# EAGLE design kinesisBLE V3 (EAGLE 9.1.3)
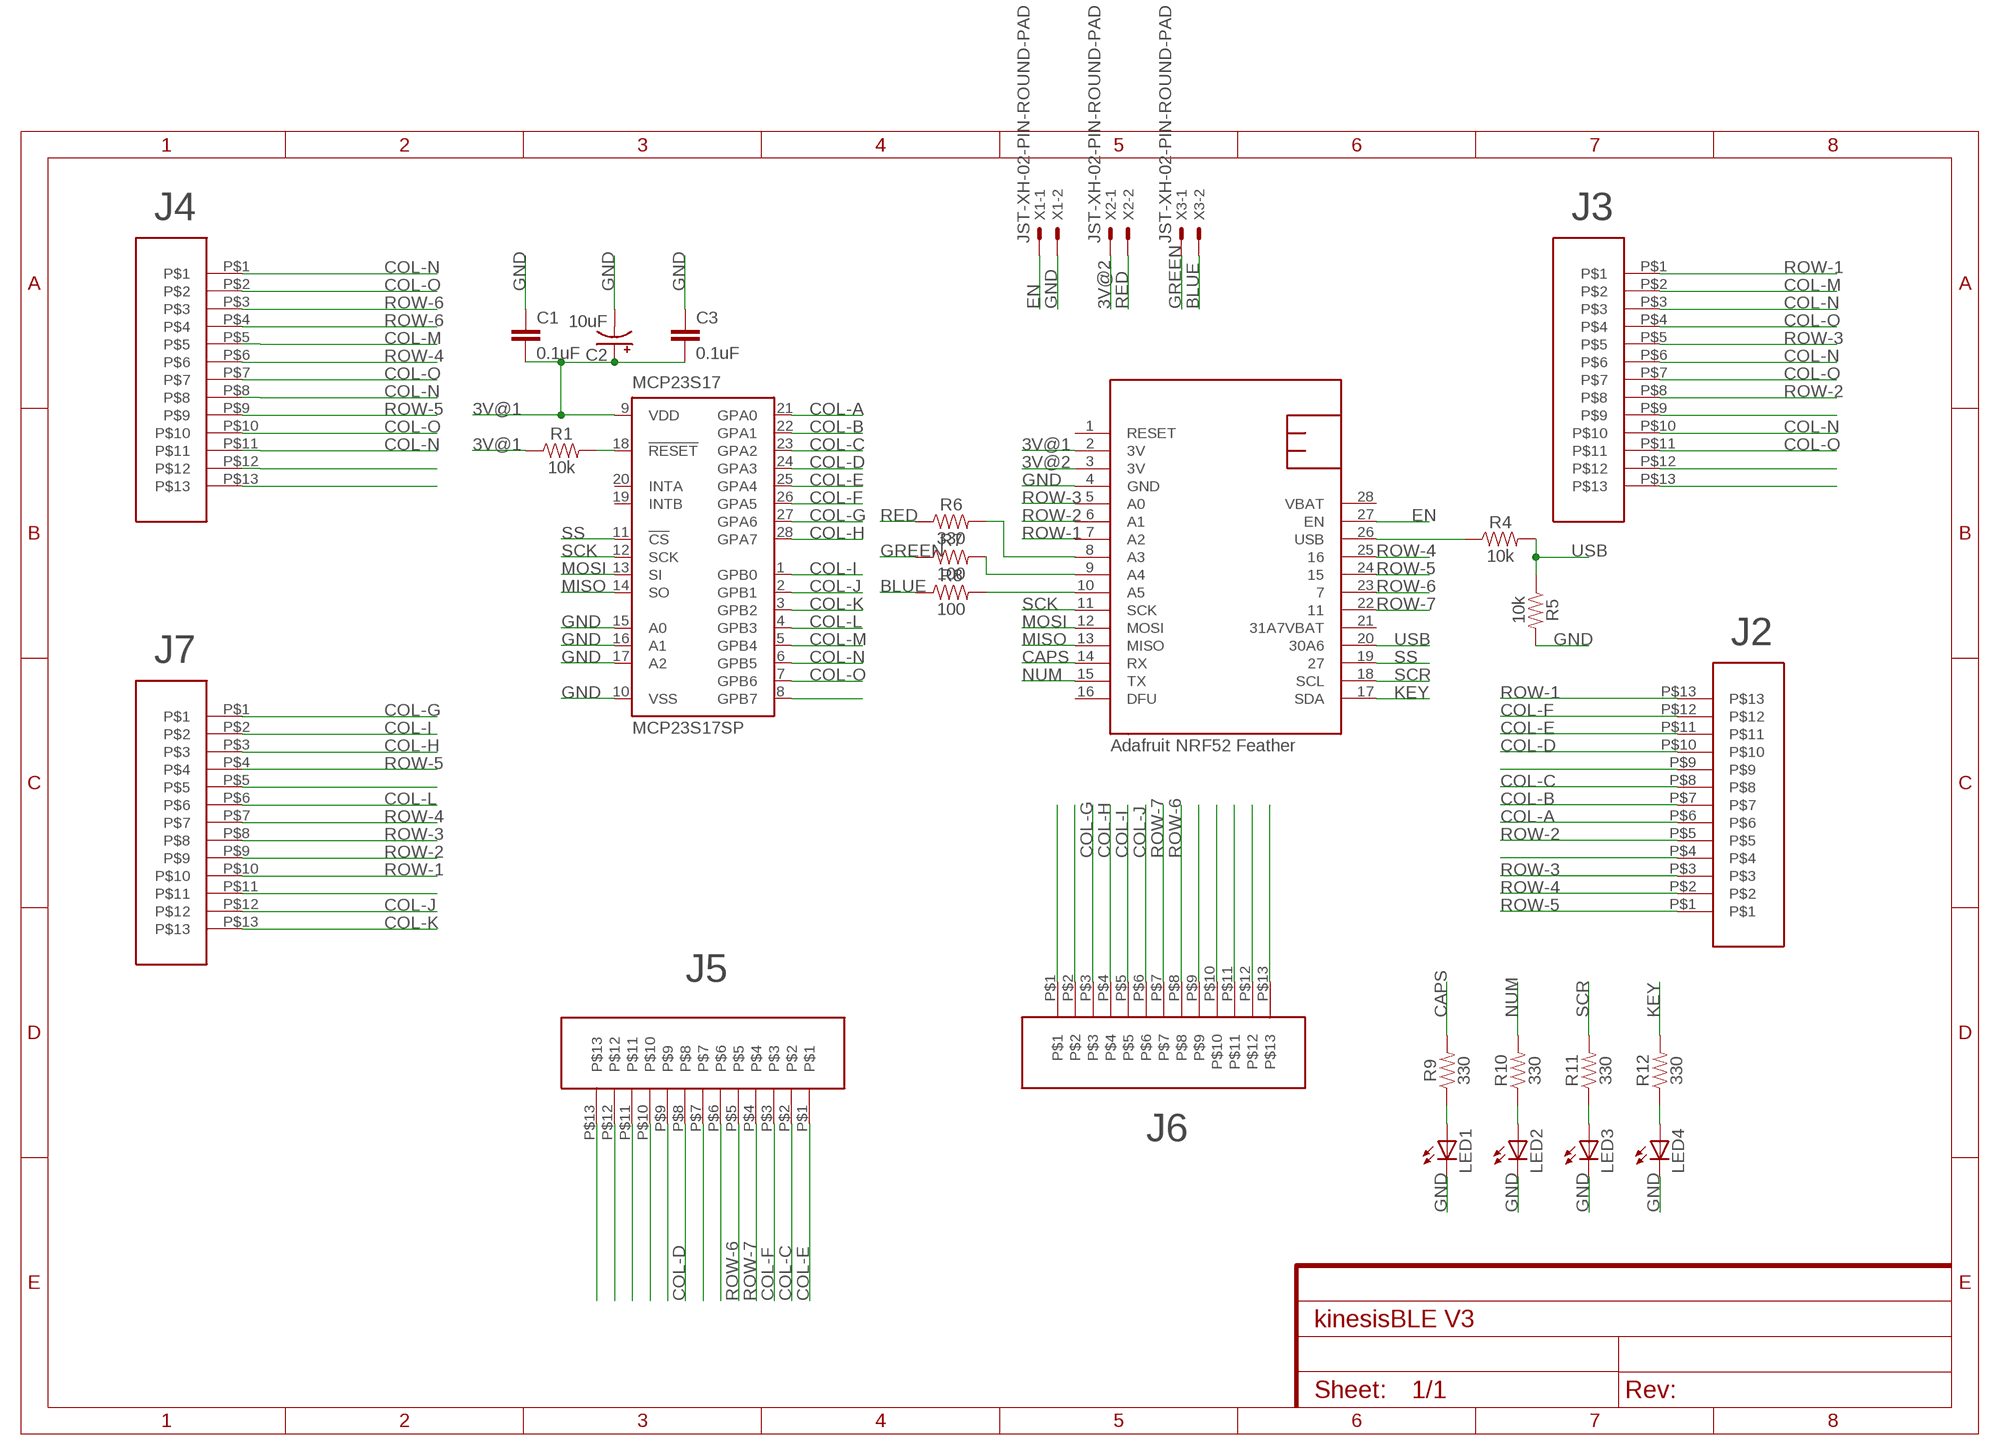
[diagram p0: schematic, sheet 1]

## Parts
C1  0.1uF  0.1UF-KIT-EZ-50V-20%  [CAP-PTH-SMALL-KIT]
C2  10uF  10UF-POLAR-RADIAL-2.5MM-25V-20%  [CPOL-RADIAL-2.5MM-5MM]
C3  0.1uF  0.1UF-KIT-EZ-50V-20%  [CAP-PTH-SMALL-KIT]
LED1  LED3MM  [LED3MM]
LED2  LED3MM  [LED3MM]
LED3  LED3MM  [LED3MM]
LED4  LED3MM  [LED3MM]
MCP23S17  MCP23S17SP  [DIL28-3]
R1  10k  10KOHM-HORIZ-1/4W-5%  [AXIAL-0.3]
R4  10k  10KOHM-HORIZ-1/4W-5%  [AXIAL-0.3]
R5  10k  10KOHM-HORIZ-1/4W-5%  [AXIAL-0.3]
R6  330  330OHM-HORIZ-1/10W-5%  [AXIAL-0.3]
R7  100  100OHM-HORIZ-1/4W-1%  [AXIAL-0.3]
R8  100  100OHM-HORIZ-1/4W-1%  [AXIAL-0.3]
R9  330  330OHM-HORIZ-1/10W-5%  [AXIAL-0.3]
R10  330  330OHM-HORIZ-1/10W-5%  [AXIAL-0.3]
R11  330  330OHM-HORIZ-1/10W-5%  [AXIAL-0.3]
R12  330  330OHM-HORIZ-1/10W-5%  [AXIAL-0.3]
U$1  NRF52FEATHER  [NRF52FEATHER]
U$2  TOPLINKS_STAPELBERG  [TOPLINKS_STAPELBERG]
U$3  TOPLINKS_STAPELBERG  [TOPLINKS_STAPELBERG]
U$4  TOPLINKS_STAPELBERG  [TOPLINKS_STAPELBERG]
U$5  TOPLINKS_STAPELBERG  [TOPLINKS_STAPELBERG]
U$6  TOPLINKS_STAPELBERG  [TOPLINKS_STAPELBERG]
U$7  TOPLINKS_STAPELBERG  [TOPLINKS_STAPELBERG]
X1  JST-XH-02-PIN-ROUND-PAD  [JST-XH-02-PACKAGE-ROUND-PAD]
X2  JST-XH-02-PIN-ROUND-PAD  [JST-XH-02-PACKAGE-ROUND-PAD]
X3  JST-XH-02-PIN-ROUND-PAD  [JST-XH-02-PACKAGE-ROUND-PAD]

## Nets
3V@1: C1.2 C2.1(+) C3.2 MCP23S17.9(VDD) R1.P$1 U$1.2(3V)
3V@2: U$1.3(3V) X2.1
BLUE: R8.P$1 X3.2
CAPS: R9.P$2 U$1.14(RX)
COL-A: MCP23S17.21(GPA0) U$5.P$6
COL-B: MCP23S17.22(GPA1) U$5.P$7
COL-C: MCP23S17.23(GPA2) U$5.P$8 U$6.P$2
COL-D: MCP23S17.24(GPA3) U$5.P$10 U$6.P$8
COL-E: MCP23S17.25(GPA4) U$5.P$11 U$6.P$1
COL-F: MCP23S17.26(GPA5) U$5.P$12 U$6.P$3
COL-G: MCP23S17.27(GPA6) U$4.P$1 U$7.P$3
COL-H: MCP23S17.28(GPA7) U$4.P$3 U$7.P$4
COL-I: MCP23S17.1(GPB0) U$4.P$2 U$7.P$5
COL-J: MCP23S17.2(GPB1) U$4.P$12 U$7.P$6
COL-K: MCP23S17.3(GPB2) U$4.P$13
COL-L: MCP23S17.4(GPB3) U$4.P$6
COL-M: MCP23S17.5(GPB4) U$2.P$5 U$3.P$2
COL-N: MCP23S17.6(GPB5) U$2.P$1 U$2.P$8 U$2.P$11 U$3.P$3 U$3.P$6 U$3.P$10
COL-O: MCP23S17.7(GPB6) U$2.P$2 U$2.P$7 U$2.P$10 U$3.P$4 U$3.P$7 U$3.P$11
EN: U$1.27(EN) X1.1
GND: C1.1 C2.2(-) C3.1 LED1.K(C) LED2.K(C) LED3.K(C) LED4.K(C) MCP23S17.10(VSS) MCP23S17.15(A0) MCP23S17.16(A1) MCP23S17.17(A2) R5.P$2 U$1.4(GND) X1.2
GREEN: R7.P$1 X3.1
KEY: R12.P$2 U$1.17(SDA)
MISO: MCP23S17.14(SO) U$1.13(MISO)
MOSI: MCP23S17.13(SI) U$1.12(MOSI)
N$1: LED1.A R9.P$1
N$2: U$3.P$13
N$3: U$3.P$12
N$4: MCP23S17.18(!RESET) R1.P$2
N$5: R4.P$1 U$1.26(USB)
N$6: U$3.P$9
N$7: R6.P$2 U$1.8(A3)
N$8: R7.P$2 U$1.9(A4)
N$9: R8.P$2 U$1.10(A5)
N$10: LED2.A R10.P$1
N$11: LED3.A R11.P$1
N$12: LED4.A R12.P$1
N$19: U$5.P$9
N$21: MCP23S17.8(GPB7)
N$24: U$5.P$4
N$39: U$2.P$12
N$40: U$2.P$13
N$44: U$4.P$5
N$50: U$4.P$11
N$54: U$6.P$13
N$55: U$6.P$11
N$56: U$6.P$12
N$57: U$6.P$10
N$58: U$6.P$9
N$60: U$6.P$7
N$61: U$6.P$6
N$67: U$7.P$1
N$68: U$7.P$2
N$75: U$7.P$9
N$76: U$7.P$10
N$77: U$7.P$11
N$78: U$7.P$12
N$79: U$7.P$13
NUM: R10.P$2 U$1.15(TX)
RED: R6.P$1 X2.2
ROW-1: U$1.7(A2) U$3.P$1 U$4.P$10 U$5.P$13
ROW-2: U$1.6(A1) U$3.P$8 U$4.P$9 U$5.P$5
ROW-3: U$1.5(A0) U$3.P$5 U$4.P$8 U$5.P$3
ROW-4: U$1.25 U$2.P$6 U$4.P$7 U$5.P$2
ROW-5: U$1.24 U$2.P$9 U$4.P$4 U$5.P$1
ROW-6: U$1.23 U$2.P$3 U$2.P$4 U$6.P$5 U$7.P$8
ROW-7: U$1.22 U$6.P$4 U$7.P$7
SCK: MCP23S17.12(SCK) U$1.11(SCK)
SCR: R11.P$2 U$1.18(SCL)
SS: MCP23S17.11(!CS) U$1.19
USB: R4.P$2 R5.P$1 U$1.20(30A6)
Unconnected: MCP23S17.19(INTB) MCP23S17.20(INTA) U$1.1(RESET) U$1.16(DFU) U$1.21(31A7VBAT)

## Notes on the sheet
- J4 | J3
- J2
- J7
- Adafruit NRF52 Feather
- J5
- J6

## Power pins joined to a net without a drawn wire
VBAT: U$1.28(VBAT)

## Library data of the parts
C1 C3 = SparkFun-Capacitors:0.1UF: 0.1µF ceramic capacitors A capacitor is a passive two-terminal electrical component used to store electrical energy temporarily in an electric field.; PROD_ID: CAP-08370
C2 = SparkFun-Capacitors:10UF-POLAR: 10.0µF polarized capacitors A capacitor is a passive two-terminal electrical component used to store electrical energy temporarily in an electric field.; PROD_ID: CAP-08440
LED1-LED4 = adafruit:LED: LED OSRAM: - CHIPLED LG R971, LG N971, LY N971, LG Q971, LY Q971, LO R971, LY R971 LH N974, LH R974 LS Q976, LO Q976, LY Q976 LO Q996 - Hyper CHIPLED LW Q18S LB Q993, LB Q99A, LB R99A - SideLED LS A670, LO A670, LY A670, LG A670, LP A670 LB A673, LV A673, LT A673, LW A673 LH A674 LY A675 LS A676, LA A676, LO A676, LY A676, LW A676 LS A679, LY A679, LG A679 - Hyper Micro SIDELED® LS Y876, LA Y876, LO Y876, LY Y876 LT Y87S - SmartLED LW L88C, LW L88S LB L89C, LB L89S, LG L890 LS L89K, LO L89K, LY L89K LS L896, LA L896, LO L896, LY L896 - TOPLED LS T670, LO T670, LY T670, LG T670, LP T670 LSG T670, LSP T670, LSY T670, LOP T670, LYG T670 LG T671, LOG T671, LSG T671 LB T673, LV T673, LT T673, LW T673 LH T674 LS T676, LA T676, LO T676, LY T676, LB T676, LH T676, LSB T676, LW T676 LB T67C, LV T67C, LT T67C, LS T67K, LO T67K, LY T67K, LW E67C LS E67B, LA E67B, LO E67B, LY E67B, LB E67C, LV E67C, LT E67C LW T67C LS T679, LY T679, LG T679 LS T770, LO T770, LY T770, LG T770, LP T770 LB T773, LV T773, LT T773, LW T773 LH T774 LS E675, LA E675, LY E675, LS T675 LS T776, LA T776, LO T776, LY T776, LB T776 LHGB T686 LT T68C, LB T68C - Hyper Mini TOPLED® LB M676 - Mini TOPLED Santana® LG M470 LS M47K, LO M47K, LY M47K Source: http://www.osram.convergy.de/
MCP23S17 = microchip:MCP23S17: http://ww1.microchip.com/downloads/en/DeviceDoc/21952a.pdf Source: http://ww1.microchip.com/downloads/en/DeviceDoc/21952a.pdf; MF: MICROCHIP; MPN: MCP23S17-E/SP; OC_FARNELL: 1292238; OC_NEWARK: 31K2951
R1 R4 R5 = SparkFun-Resistors:10KOHM: 10kΩ resistor A resistor is a passive two-terminal electrical component that implements electrical resistance as a circuit element. Resistors act to reduce current flow, and, at the same time, act to lower voltage levels within circuits. - Wikipedia; PROD_ID: RES-09435
R6 R9-R12 = SparkFun-Resistors:330OHM: 330Ω resistor A resistor is a passive two-terminal electrical component that implements electrical resistance as a circuit element. Resistors act to reduce current flow, and, at the same time, act to lower voltage levels within circuits. - Wikipedia; PROD_ID: RES-8371
R7 R8 = SparkFun-Resistors:100OHM: 100Ω resistor A resistor is a passive two-terminal electrical component that implements electrical resistance as a circuit element. Resistors act to reduce current flow, and, at the same time, act to lower voltage levels within circuits. - Wikipedia; PROD_ID: RES-12181
U$1 = mike:NRF52FEATHER
U$2-U$7 = con-molex-39-53:TOPLINKS_STAPELBERG
X1-X3 = Rembrandt Electronics - JST XH Connectors v1-0:JST-XH-02-PIN: JST XH Connector 2 Pin Wire to board connector. Pitch: 2,54 mm, (0.100") Number of pins: 2 Created by Rembrandt Electronics www.rembrandtelectronics.com

## Board
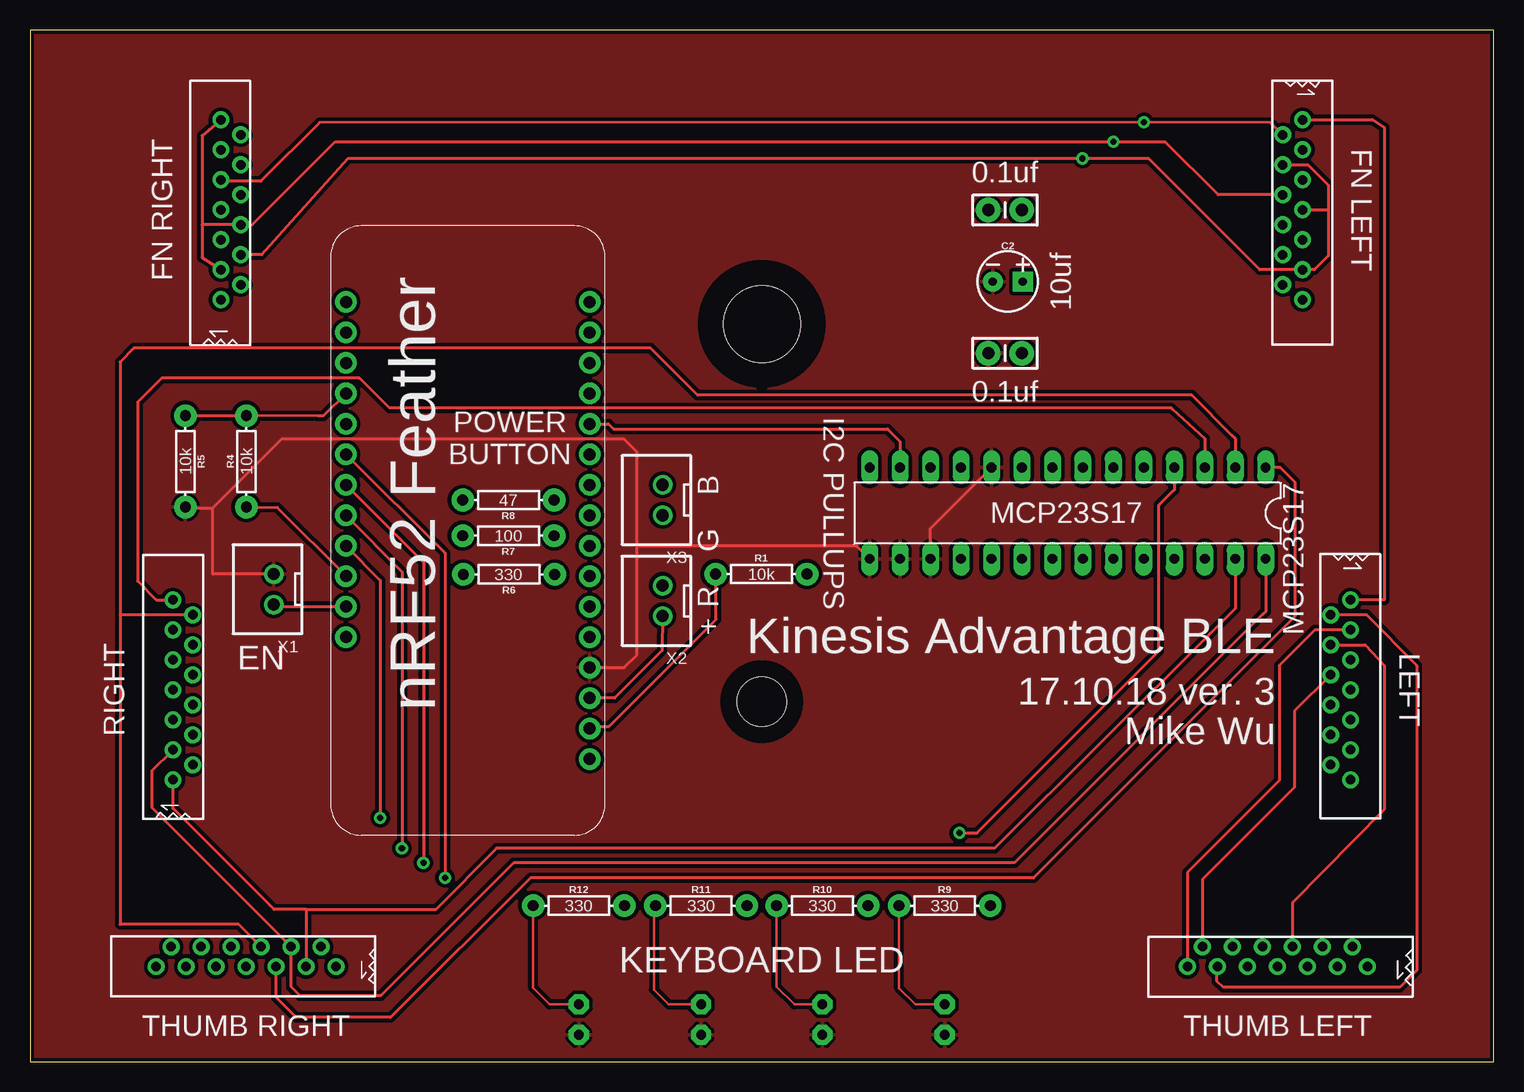
[diagram p1: board, top side]
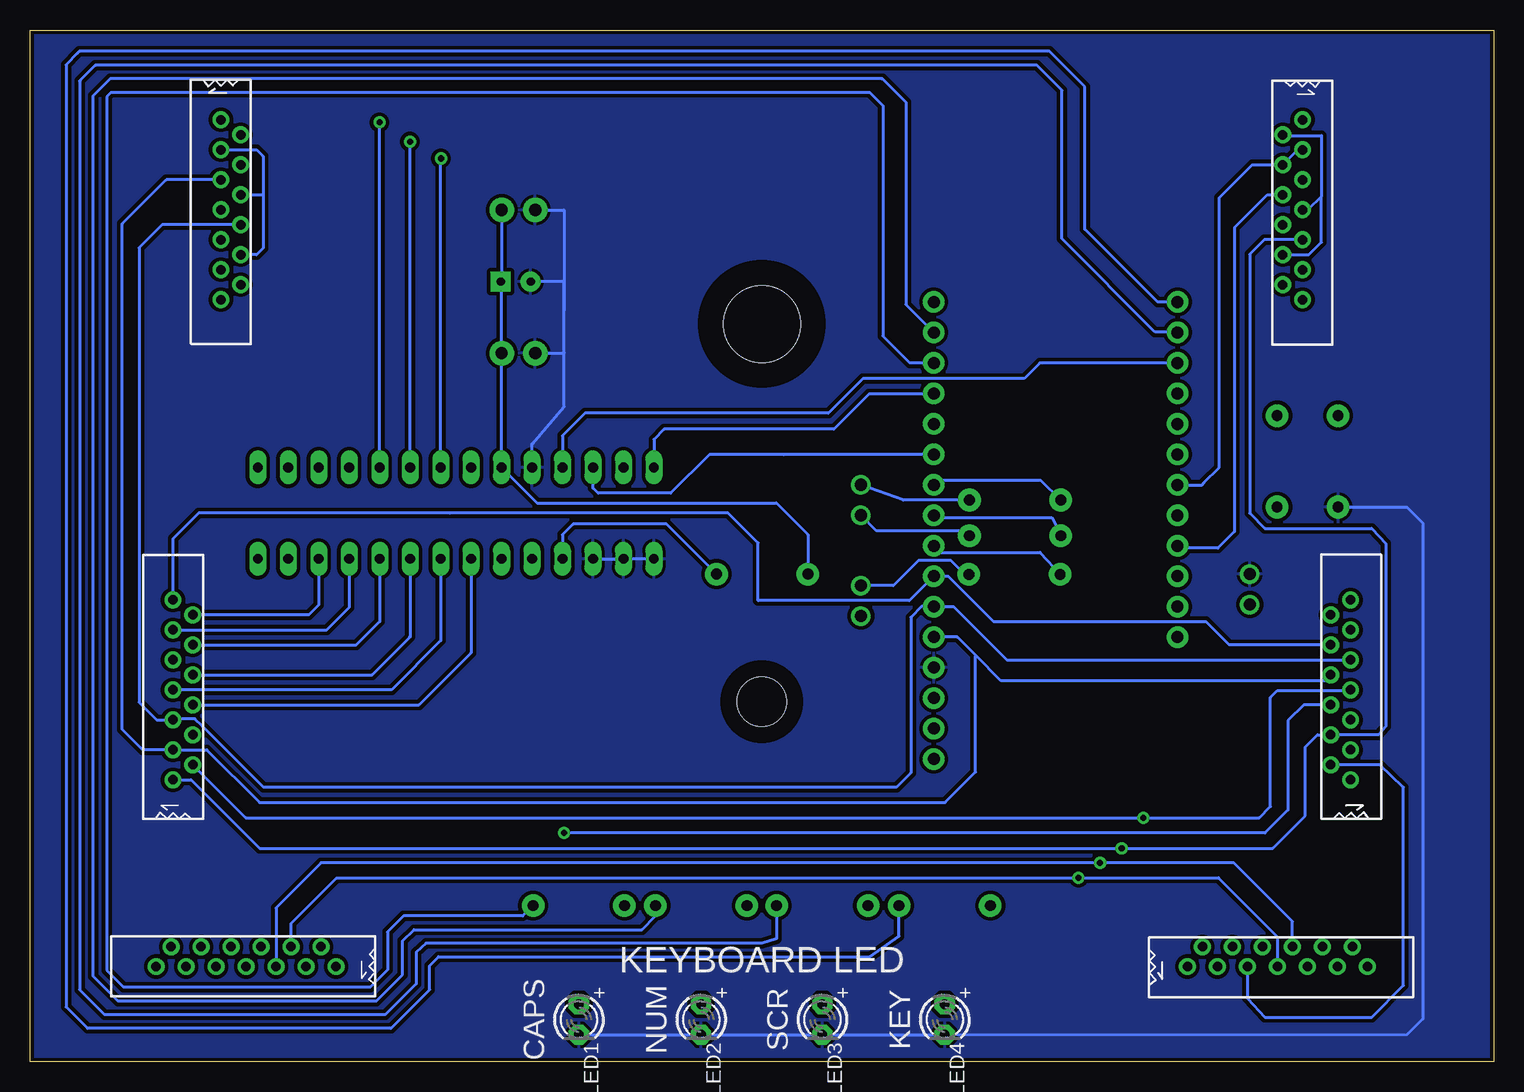
[diagram p2: board, bottom side, seen from below]

Size 122 x 86 mm. Coordinates in mm from the lower left corner, seen from the top.
Outline: 0,0 122,0 122,86 0,86 0,0
Copper layers (1*16): Top 0.035mm / dielectric 1.5mm / Bottom 0.035mm
Design rules "SparkFun": minimum track width 8mil, minimum drill 20mil, track to track 8mil, track to pad 8mil, pad to pad 8mil, via to via 8mil, smd to smd 8mil, copper to edge 10mil, drill to drill 8mil, minimum pad ring 12mil, minimum via ring 10mil, stop-mask expansion 4mil, vias tented up to drill 25mil, thermal gap 10mil
Holes 6.4 mm at 61,61.5
Holes 4.1 mm at 61,30
tKeepout: area 56,56.5 to 66,66.5; area 58.4,27.4 to 63.6,32.6
bKeepout: area 56,56.5 to 66,66.5; area 58.4,27.4 to 63.6,32.6
tRestrict: area 56,56.5 to 66,66.5; area 58.4,27.4 to 63.6,32.6
bRestrict: area 56,56.5 to 66,66.5; area 58.4,27.4 to 63.6,32.6
vRestrict: area 56,56.5 to 66,66.5; area 58.4,27.4 to 63.6,32.6

### Footprints (pad centres in the part's own frame; a part is rotated, then mirrored left to right if it is on the bottom)
CAP-PTH-SMALL-KIT = drill 1.016 pad 2.032: 1 -1.397,0; 2 1.397,0
CPOL-RADIAL-2.5MM-5MM = drill 0.7 pad 1.651 square: 1 1.25,0 | drill 0.7 pad 1.651: 2 -1.25,0
LED3MM = drill 0.813 pad 1.676 octagon: A -1.27,0; K 1.27,0
DIL28-3 = drill 0.813 long: 1 -16.51,-3.81; 2 -13.97,-3.81; 3 -11.43,-3.81; 4 -8.89,-3.81; 5 -6.35,-3.81; 6 -3.81,-3.81; 7 -1.27,-3.81; 8 1.27,-3.81; 9 3.81,-3.81; 10 6.35,-3.81; 11 8.89,-3.81; 12 11.43,-3.81; 13 13.97,-3.81; 14 16.51,-3.81; 15 16.51,3.81; 16 13.97,3.81; 17 11.43,3.81; 18 8.89,3.81; 19 6.35,3.81; 20 3.81,3.81; 21 1.27,3.81; 22 -1.27,3.81; 23 -3.81,3.81; 24 -6.35,3.81; 25 -8.89,3.81; 26 -11.43,3.81; 27 -13.97,3.81; 28 -16.51,3.81
AXIAL-0.3 = drill 0.9 pad 1.88: P$1 -3.81,0; P$2 3.81,0
NRF52FEATHER = drill 1 pad 1.778: 1 -17.78,-10.16; 2 -15.24,-10.16; 3 -12.7,-10.16; 4 -10.16,-10.16; 5 -7.62,-10.16; 6 -5.08,-10.16; 7 -2.54,-10.16; 8 0,-10.16; 9 2.54,-10.16; 10 5.08,-10.16; 11 7.62,-10.16; 12 10.16,-10.16; 13 12.7,-10.16; 14 15.24,-10.16; 15 17.78,-10.16; 16 20.32,-10.16; 17 20.32,10.16; 18 17.78,10.16; 19 15.24,10.16; 20 12.7,10.16; 21 10.16,10.16; 22 7.62,10.16; 23 5.08,10.16; 24 2.54,10.16; 25 0,10.16; 26 -2.54,10.16; 27 -5.08,10.16; 28 -7.62,10.16
TOPLINKS_STAPELBERG = drill 0.8: P$1 -0.08,7.51; P$2 1.57,6.26; P$3 -0.08,5.01; P$4 1.57,3.76; P$5 -0.08,2.51; P$6 1.57,1.26; P$7 -0.08,0.01; P$8 1.57,-1.24; P$9 -0.08,-2.49; P$10 1.57,-3.74; P$11 -0.08,-4.99; P$12 1.57,-6.24; P$13 -0.08,-7.49
JST-XH-02-PACKAGE-ROUND-PAD = drill 1.016: 1 -1.27,0; 2 1.27,0

### Placement (x,y rotation side)
C1  81.28,59.05 0 top
C2  81.51,65.02 0 top
C3  81.28,70.99 0 top
LED1  76.25,3.5 270 bottom
LED2  66.05,3.5 270 bottom
LED3  55.95,3.5 270 bottom
LED4  45.75,3.5 270 bottom
MCP23S17  86.5,45.72 180 top
R1  60.96,40.64 0 top
R4  18.03,50.04 90 top
R5  12.95,50.04 270 top
R6  39.93,40.61 180 top
R7  39.88,43.84 180 top
R8  39.88,46.81 180 top
R9  76.25,13 0 top
R10  66.05,13 0 top
R11  55.95,13 0 top
R12  45.75,13 0 top
U$1  36.5,43 90 top
U$2  16,71 0 top
U$3  106,71 0 bottom
U$4  12,31 180 bottom
U$5  110,31 180 top
U$6  104,8 90 top
U$7  18,8 90 bottom
X1  20.32,39.37 90 top
X2  52.73,38.4 90 top
X3  52.73,46.81 90 top

### Tracks (layer width: path | path; a pad name or v marks a point on that pad's centre or on a via)
3V@1
  Top 0.254: U$1.2 46.84,27.94 48.26,27.94 57.19,36.87 57.19,40.64 R1.P$1
  Bottom 0.245: C3.2 82.68,64.92
  Bottom 0.254: C2.1 82.68,64.92 C1.2 MCP23S17.9 79.73,46.57 59.79,46.57 57.15,43.94 R1.P$1
3V@2
  Top 0.254: X2.1 52.7,34.27 48.74,30.3 U$1.3
BLUE
  Bottom 0.254: R8.P$1 43.75,46.81 49.19,46.81 X3.2
CAPS
  Bottom 0.254: R9.P$2 80.93,12.13 90.87,12.13 92.2,10.8 92.2,7.64 93.64,6.2 114.19,6.2 115.6,7.62 115.6,80.42 115.22,80.8 115,80.8 60,80.8 58,80.8 52,80.8 50.9,79.7 50.9,60.48 48.66,58.24 U$1.14
COL-A
  Bottom 0.254: U$5.P$6 89.56,29.74 85.23,34.07 MCP23S17.21
COL-B
  Bottom 0.254: U$5.P$7 91.87,30.99 87.77,35.09 MCP23S17.22
COL-C
  Top 0.254: U$5.P$8 105.41,29.22 105.41,22.86 97.74,15.19 U$6.P$2
  Bottom 0.254: U$5.P$8 93.49,32.24 90.36,35.37 | 90.36,35.37 90.31,35.42 | MCP23S17.23 90.31,35.42 | 90.31,35.42 90.36,35.37
COL-D
  Top 0.254: U$5.P$10 111.31,34.74 112.9,33.02 112.9,21.03 105.24,13.24 U$6.P$8
  Bottom 0.254: U$5.P$10 94.8,34.74 92.85,36.69 MCP23S17.24
COL-E
  Top 0.254: U$6.P$1 96.49,15.77 104.14,23.42 104.14,33.02 107.11,35.99 U$5.P$11
  Bottom 0.254: U$5.P$11 97.26,35.99 95.38,37.87 95.39,37.88 MCP23S17.25
COL-F
  Top 0.254: U$5.P$12 108.44,37.25 111.41,37.25 115.6,33.01 115.6,7.62 114.17,6.2 99.47,6.2 98.94,6.68 98.94,7.87 U$6.P$3
  Bottom 0.254: U$5.P$12 98.76,37.24 97.93,38.07 MCP23S17.26
COL-G
  Top 0.203: U$7.P$3 | 33.83,12.68 33.86,12.7
  Top 0.254: U$4.P$1 11.92,21.1 20.01,13.01 20.34,12.68 23.01,12.68 | 33.86,12.7 38.89,17.78 80.42,17.78 98.34,35.66 100.47,37.79 MCP23S17.27 | 23.01,12.68 U$7.P$3 | 23.01,12.68 33.83,12.68
COL-H
  Top 0.254: U$4.P$3 10.16,24.23 10.16,21.17 U$7.P$4 21.76,6.24 22.51,5.49 29.23,5.49 40.32,16.57 82.05,16.57 102.74,37.26 103.01,37.53 MCP23S17.28
COL-I
  Top 0.254: U$7.P$5 20.52,7.91 20.52,5.33 22.17,3.68 30.05,3.68 41.71,15.31 83.66,15.31 105.43,37.11 105.43,48.32 104.22,49.53 MCP23S17.1
  Bottom 0.254: U$7.P$5 20.51,5.27 19.05,3.68 10.16,3.68 7.52,6.35 7.52,22.86 9.5,24.74 U$4.P$2
COL-J
  Top 0.254: U$7.P$6 17.4,11.43 7.52,11.43 7.52,37.24 | 100.2,52.2 100.47,51.93 MCP23S17.2 | 100.2,52.2 96.85,55.55 55.65,55.55 51.74,59.46 8.66,59.46 7.52,58.32 7.52,37.24 | 7.52,37.24 | U$4.P$12 7.52,37.24 | 7.52,37.24 | 100.2,52.2
COL-K
  Top 0.254: U$4.P$13 10.53,38.49 8.97,40.06 8.97,54.97 10.97,56.97 27.47,56.97 29.96,54.48 95.12,54.48 95.17,54.43 97.93,51.93 MCP23S17.3
COL-L  (via drill 0.51)
  Top 0.254: 95.36,47.64 94.11,46.38 94.11,34.21 78.95,19.05 v77.47,19.05 | 95.36,47.64 95.39,47.66 | MCP23S17.4 95.39,47.66 | 95.39,47.66 95.36,47.64
  Bottom 0.254: U$4.P$6 15.81,29.74 17.13,28.42 17.13,20.97 19.05,19.05 v77.47,19.05
COL-M  (via drill 0.51)
  Top 0.254: U$2.P$5 16.04,73.39 19.24,73.39 24.14,78.28 v92.86,78.3 103.41,78.28 U$3.P$2
  Bottom 0.254: MCP23S17.5 92.85,78.29 v92.86,78.3
COL-N  (via drill 0.51)
  Top 0.254: U$2.P$1 14.35,77.2 14.35,69.76 | 14.35,69.76 14.35,67.04 U$2.P$11 | 14.35,69.76 U$2.P$8 18.53,69.76 25.46,76.69 v90.32,76.69 94.62,76.69 99.05,72.26 U$3.P$6
  Bottom 0.254: U$3.P$3 103.11,76.01 102.57,75.47 102.57,72.25 104.42,72.25 U$3.P$6 102.57,72.26 102.57,67.8 103.11,67.26 U$3.P$10 | MCP23S17.6 90.31,76.67 v90.32,76.69
COL-O  (via drill 0.51)
  Top 0.203: 87.76,75.27 v87.73,75.29
  Top 0.254: U$3.P$4 106.54,74.76 108.25,73.05 108.25,71.04 | 108.25,71.04 108.25,67.18 107.08,66.01 U$3.P$11 102.52,66.01 93.27,75.27 87.76,75.27 | U$2.P$10 19.32,67.26 26.54,75.29 v87.73,75.29 | U$3.P$7 108.21,71.01 108.25,71.04
  Bottom 0.203: 87.77,75.25 v87.73,75.29
  Bottom 0.254: U$2.P$2 17.51,77.2 14.35,77.2 14.35,72.12 | 14.35,72.12 15.46,71.01 U$2.P$7 | U$2.P$10 15.4,67.26 14.35,68.31 14.35,72.12 | MCP23S17.7 87.77,75.25
EN
  Top 0.254: X1.1 20.5,37.92 U$1.27
GND
  Top 0.254: 15.21,46.14 13.05,46.14 R5.P$2 | 15.21,46.14 20.96,51.89 49.53,51.89 50.6,50.83 50.6,43 | 50.6,43 50.6,34 50.6,33.91 49.52,32.84 U$1.4 | X1.2 15.24,40.64 15.21,40.67 15.21,46.14 | MCP23S17.17 75.07,44.45 MCP23S17.10 | MCP23S17.15 68.9,43 50.6,43
  Bottom 0.203: LED4.K 7.22,2.23
  Bottom 0.245: C3.1 77.5,70.99 77.48,70.98 77.48,62.62 77.47,62.61
  Bottom 0.254: 77.47,59.08 77.47,54.61 80.16,51.49 80.15,51.47 MCP23S17.10 | 77.47,59.08 77.47,62.61 77.47,65.02 C2.2 | C1.1 77.47,59.08 | R5.P$2 7.23,46.23 5.89,44.89 5.89,3.56 7.22,2.23 | LED1.K LED2.K LED3.K LED4.K | MCP23S17.17 MCP23S17.16 MCP23S17.15
  pour Top (isolate 0.305): 0,86 122,86 122,0 121.92,0 0,0
  pour Bottom (isolate 0.305): 0,86 122,86 122,0 0,0
GREEN
  Bottom 0.254: R7.P$1 44.19,44.24 51.43,44.24 X3.1
KEY
  Bottom 0.254: R12.P$2 49.56,10.44 52,8.74 87.94,8.74 88.68,8 88.68,6 91.91,2.77 117.2,2.77 118.99,4.56 118.99,83.1 118.05,84.05 | 118.05,84.05 117.88,84.21 37.02,84.21 34.07,81.27 34.07,69.39 28,63.32 U$1.17 | 118.05,84.05
MISO
  Bottom 0.254: U$1.13 46.7,55.66 52.05,55.66 54.99,52.71 69.14,52.71 69.99,51.86 MCP23S17.14
MOSI
  Top 0.254: MCP23S17.13 72.53,51.69 71.48,52.73 48.65,52.73 48.23,53.16 U$1.12
N$1
  Top 0.203: LED1.A 73.79,4.77 72.44,6.12 R9.P$1
N$4
  Bottom 0.254: R1.P$2 68.94,44.81 76.72,44.81 77.61,43.92 MCP23S17.18
N$5
  Top 0.254: R4.P$1 20.61,46.19 U$1.26
N$7
  Bottom 0.254: R6.P$2 37.79,42.44 46.1,42.44 U$1.8
N$8
  Bottom 0.254: R7.P$2 36.83,45.34 46.46,45.34 U$1.9
N$9
  Bottom 0.254: R8.P$2 37.77,48.46 45.14,48.46 45.14,48.47 46.27,48.47 U$1.10
N$10
  Top 0.203: LED2.A 63.71,4.77 62.24,6.24 R10.P$1
N$11
  Top 0.203: R11.P$1 52,12.86 52,6 53.23,4.77 LED3.A
N$12
  Top 0.203: LED4.A 43.31,4.77 41.94,6.14 R12.P$1
NUM
  Bottom 0.254: R10.P$2 69.86,12.14 71,11 90,11 90.94,10.06 90.94,7.25 93.15,5.03 114.65,5.03 116.73,7.11 116.73,80.52 115.32,81.93 51,81.93 50.93,81.93 49,80 49,63.12 U$1.15
RED
  Bottom 0.254: R6.P$1 44.07,40.62 45.22,41.76 47.95,41.76 50.03,39.67 X2.2
ROW-1
  Top 0.254: U$5.P$13 112.9,38.49 112.9,77.84 111.88,78.53 106.1,78.53 U$3.P$1
  Bottom 0.254: U$5.P$13 110.08,43.59 107.95,45.72 87,45.72 63.79,45.72 61.31,43.24 61.31,38.43 48.69,38.43 U$1.7 45.46,40.46 42,37 | U$4.P$10 22.04,34.74 23.98,36.68 41.68,36.68 | 42,37 41.68,36.68 | 42,37 41.68,36.68
ROW-2
  Bottom 0.254: 110.49,28.49 111.44,28.49 112.9,29.96 112.9,67.84 110.99,69.76 U$3.P$8 | 110.49,28.49 U$5.P$5 | 110.49,28.49 110.41,28.57 108.26,28.57 107.62,27.93 107.62,27.94 102.54,22.86 49.78,22.86 48.57,24.07 48.57,37.03 47.68,37.92 U$1.6 45,37.92 40.57,33.49 U$4.P$9
ROW-3
  Bottom 0.254: U$3.P$5 110.64,73.51 114.3,69.85 114.3,27.67 112.62,25.99 | 112.62,25.99 U$5.P$3 107.27,25.99 102.87,21.59 45.72,21.59 43.18,24.13 43.18,33.82 43.16,33.84 | 112.62,25.99 | U$4.P$8 14.06,31.75 41.06,31.75 43.16,33.84 | 43.16,33.84 44.69,35.38 U$1.5
ROW-4  (via drill 0.51)
  Top 0.254: U$1.25 29.2,40.1 v29.2,20.32
  Bottom 0.254: U$2.P$6 18.84,72.26 21.59,69.51 21.59,44.17 22.96,42.8 22.96,42.82 26.16,42.82 U$1.25 | U$5.P$2 104.01,20.32 v29.2,20.32 19.53,20.32 18.59,21.26 18.59,30.35 18,30.94 11.97,30.94 U$4.P$7
ROW-5  (via drill 0.51)
  Top 0.254: U$1.24 31,40.82 v31,17.78
  Bottom 0.254: U$2.P$9 19.12,68.51 20.32,67.31 20.32,45.72 19.05,44.45 10.16,44.45 8.97,43.18 8.97,27.94 9.59,27.24 U$4.P$4 14.67,27.24 15.7,26.21 15.7,20.5 18.41,17.78 v31,17.78 102.87,17.78 108.58,23.49 U$5.P$1
ROW-6  (via drill 0.51)
  Top 0.203: 32.82,16.59 v32.8,16.57
  Top 0.254: U$1.23 32.82,41.6 32.82,16.59
  Bottom 0.254: U$7.P$8 16.76,11.68 21.64,16.56 v32.8,16.57 97.74,16.57 101.5,12.8 U$6.P$5 | U$1.23 24.31,48.08 24.13,48.26 22.86,49.53 22.86,72.01 20.11,74.76 U$2.P$4 16.32,76.01 U$2.P$3
ROW-7  (via drill 0.51)
  Top 0.254: U$1.22 34.6,42.39 v34.6,15.32
  Bottom 0.254: U$6.P$4 100.24,11.52 96.44,15.31 v34.6,15.32 22.94,15.32 18.01,10.39 U$7.P$7
SCK
  Bottom 0.254: MCP23S17.12 75.07,47.81 74.64,47.38 68.59,47.38 65.38,50.6 59.17,50.6 59.15,50.62 U$1.11
SCR
  Bottom 0.254: R11.P$2 59.76,10.24 61,9.87 88.99,9.87 89.81,9.12 89.81,6.47 92.38,3.9 94,3.9 | 94,3.9 115.76,3.9 117.86,6 117.86,81.75 | 94,3.9 | 117.86,81.75 117.81,81.81 | 117.81,81.81 116.55,83.06 38.06,83.06 35.97,80.97 35.97,68.59 28.21,60.83 26.39,60.83 U$1.18 | 117.81,81.81 117.86,81.75
SS
  Bottom 0.254: MCP23S17.11 77.61,52.17 75.73,54.05 55.45,54.05 52.55,56.95 39.12,56.95 37.82,58.24 U$1.19
USB
  Top 0.254: R5.P$1 R4.P$2 24,53.81 24.45,53.81 U$1.20

### Text on the board
tPlace: 0.1uf | FN RIGHT | FN LEFT | 10uf | 0.1uf | POWER / BUTTON | 10k | 10k | 47 | B | I2C PULLUPS | MCP23S17 | 100 | G | 330 | 10k | R | + | EN | Kinesis Advantage BLE | RIGHT | LEFT | 17.10.18 ver. 3 | nRF52 Feather | Mike Wu | 330 | 330 | 330 | 330 | KEYBOARD LED | THUMB RIGHT | THUMB LEFT
bPlace: KEYBOARD LED | KEY | SCR | NUM | CAPS